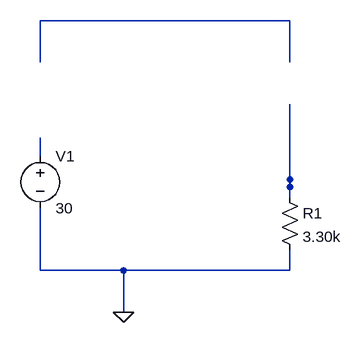
[diagram p0: schematic pannel4.asc]
pannel4.asc, the LTspice schematic file:
Version 4
SHEET 1 880 680
WIRE 640 528 640 500
WIRE 640 640 640 608
SYMBOL res 624 512 R0
SYMATTR InstName R1
SYMATTR Value 3.30k
FLAG 384 704 0
WIRE 256 464 256 436
WIRE 256 576 256 544
SYMBOL voltage 256 448 R0
SYMATTR InstName V1
SYMATTR Value 30
WIRE 640 448 640 512
WIRE 640 384 640 448
WIRE 576 640 640 640
WIRE 256 640 320 640
WIRE 256 576 256 640
WIRE 256 256 256 320
WIRE 256 256 320 256
WIRE 640 256 640 320
WIRE 576 256 640 256
WIRE 384 256 448 256
WIRE 320 256 384 256
WIRE 384 640 384 704
WIRE 384 640 448 640
WIRE 320 640 384 640
WIRE 512 256 576 256
WIRE 512 640 576 640
WIRE 448 640 512 640
WIRE 448 256 512 256

The netlist it stands for:
* pannel4.asc
R1 N001 0 3.30k
V1 N002 0 30
.backanno
.end